# EAGLE design Group12_411_REV3 (EAGLE 9.2.2)
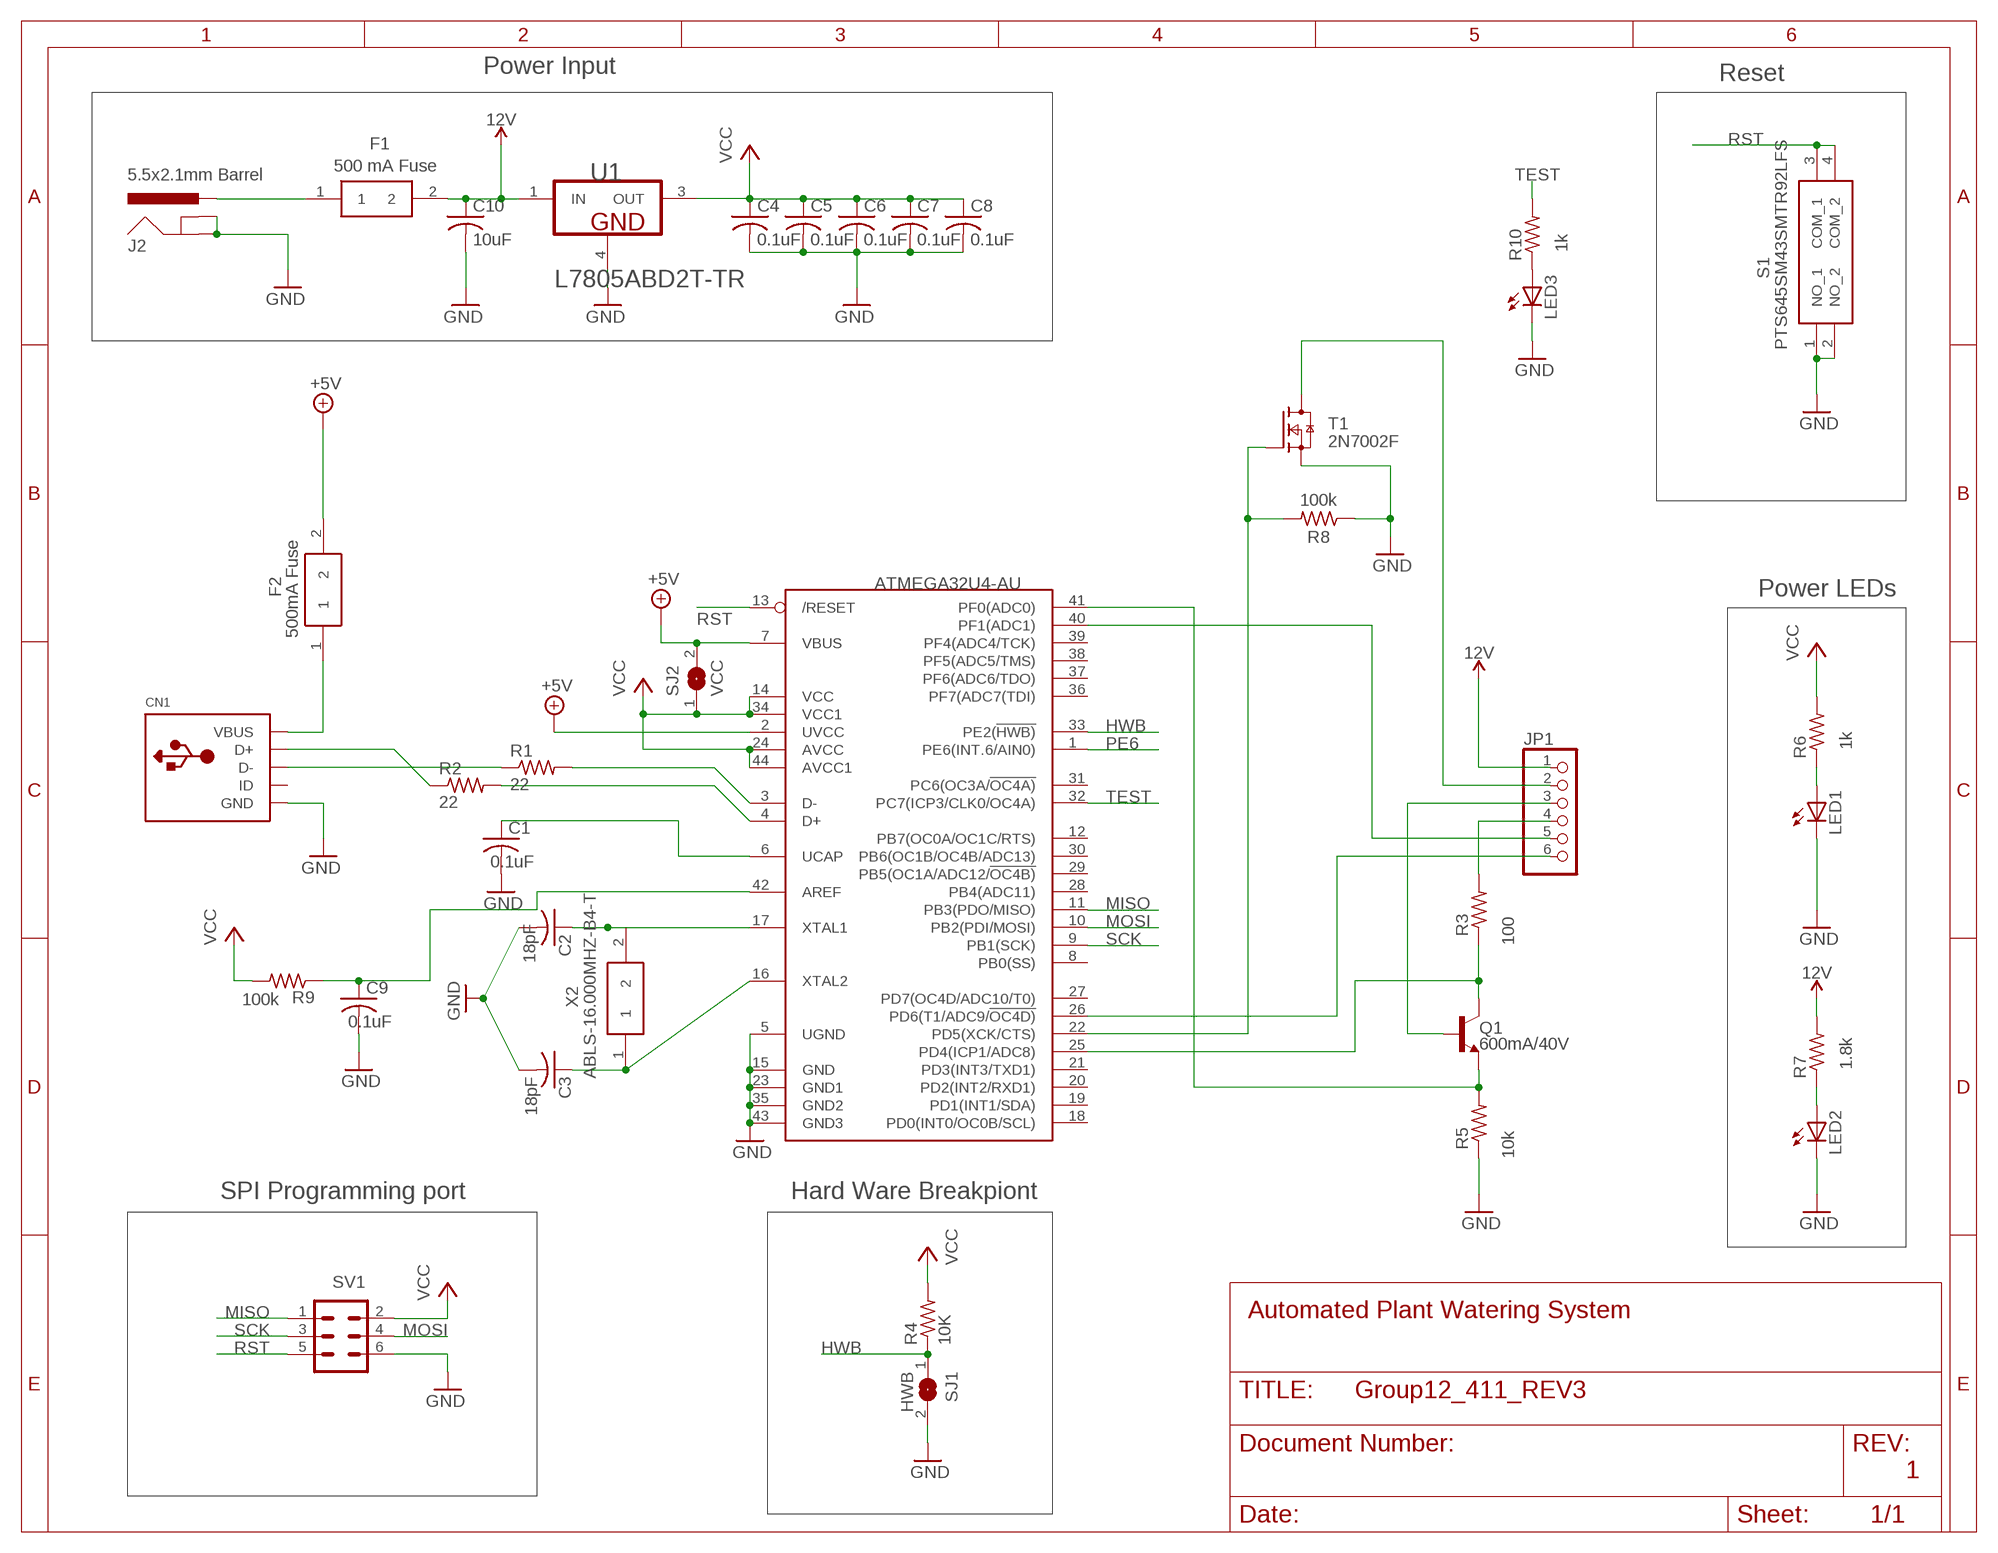
[diagram p0: schematic, sheet 1]
FRAME1 (FRAME_A_L): REV: 1

## Parts
C1  0.1uF  C-USC0805K  [C0805K]
C2  18pF  C-USC0805K  [C0805K]
C3  18pF  C-USC0805K  [C0805K]
C4  0.1uF  C-USC0805K  [C0805K]
C5  0.1uF  C-USC0805K  [C0805K]
C6  0.1uF  C-USC0805K  [C0805K]
C7  0.1uF  C-USC0805K  [C0805K]
C8  0.1uF  C-USC0805K  [C0805K]
C9  0.1uF  C-USC0805K  [C0805K]
C10  10uF  C-USC0805K  [C0805K]
CN1  USBMINIB  [USB-MINIB]
F1  MFU0805FF00500P100  [FUSC2012X55N]
F2  MFU0805FF00500P100  [FUSC2012X55N]
J2  5.5x2.1mm Barrel  POWER_JACKSMD  [POWER_JACK_SMD]
JP1  PINHD-1X6-3.5MM  [1X06-3.5MM]
LED1  LEDCHIP-LED0603  [CHIP-LED0603]
LED2  LEDCHIP-LED0603  [CHIP-LED0603]
LED3  LEDCHIP-LED0603  [CHIP-LED0603]
Q1  600mA/40V  TRANS_NPN-MMBT2222AL  [SOT23-3]
R1  22  R-US_R0805  [R0805]
R2  22  R-US_R0805  [R0805]
R3  22  R-US_R0805  [R0805]
R4  10K  R-US_R0805  [R0805]
R5  22  R-US_R0805  [R0805]
R6  10K  R-US_R0805  [R0805]
R7  10K  R-US_R0805  [R0805]
R8  10K  R-US_R0805  [R0805]
R9  100k  R-US_R0805  [R0805]
R10  10K  R-US_R0805  [R0805]
S1  PTS645SM43SMTR92LFS  [PTS645SMT]
SJ1  HWB  SJ  [SJ]
SJ2  VCC  SJ  [SJ]
SV1  MA03-2  [MA03-2]
T1  2N7002F  [SOT23]
U1  STMICROELECTRONICS_L7805ABD2T-TRSTMICROELECTRONICS_L7805ABD2T-TR_0_0  [STMICROELECTRONICS_L7805ABD2T-TR_0]
U2  ATMEGA32U4-AU  [TQFP44]
X2  ABLS-16.000MHZ-B4-T  [ABLS]

## Nets
12V: C10.1 F1.2 JP1.1 R7.2 U1.1(IN)
+5V: F2.2 SJ2.2 U2.2(UVCC) U2.7(VBUS)
GND: C1.2 C2.2 C3.2 C4.2 C5.2 C6.2 C7.2 C8.2 C9.2 C10.2 CN1.GND J2.GND(GNDBREAK) J2.P$4(GND) LED1.C LED2.C LED3.C R5.1 R8.1 S1.1(NO_1) S1.2(NO_2) SJ1.2 SV1.6 T1.2(S) U1.4(GND) U2.5(UGND) U2.15(GND) U2.23(GND1) U2.35(GND2) U2.43(GND3)
HWB: R4.1 SJ1.1 U2.33(PE2(!HWB))
MISO: SV1.1 U2.11(PB3(PDO/MISO))
MOSI: SV1.4 U2.10(PB2(PDI/MOSI))
N$1: LED3.A R10.1
N$2: CN1.D+ R2.1
N$3: JP1.4 R3.2
N$4: R2.2 U2.4(D+)
N$5: CN1.D- R1.1
N$6: C1.1 U2.6(UCAP)
N$7: R1.2 U2.3(D-)
N$8: C2.1 U2.17(XTAL1) X2.2
N$9: C3.1 U2.16(XTAL2) X2.1
N$10: LED1.A R6.1
N$11: Q1.3(C) R3.1 U2.25(PD4(ICP1/ADC8))
N$12: Q1.2(E) R5.2 U2.41(PF0(ADC0))
N$13: JP1.3 Q1.1(B)
N$14: JP1.2 T1.3(D)
N$15: LED2.A R7.1
N$16: F1.1 J2.VIN0(PWR)
N$17: CN1.VBUS F2.1
N$18: R8.2 T1.1(G) U2.22(PD5(XCK/CTS))
N$19: JP1.5 U2.40(PF1(ADC1))
N$20: JP1.6 U2.26(PD6(T1/ADC9/!OC4D))
N$23: C9.1 R9.1 U2.42(AREF)
PE6: U2.1(PE6(INT.6/AIN0))
RST: S1.3(COM_1) S1.4(COM_2) SV1.5 U2.13(/RESET)
SCK: SV1.3 U2.9(PB1(SCK))
TEST: R10.2 U2.32(PC7(ICP3/CLK0/OC4A))
VCC: C4.1 C5.1 C6.1 C7.1 C8.1 R4.2 R6.2 R9.2 SJ2.1 SV1.2 U1.3(OUT) U2.14(VCC) U2.24(AVCC) U2.34(VCC1) U2.44(AVCC1)
Unconnected: CN1.ID U2.8(PB0(SS)) U2.12(PB7(OC0A/OC1C/RTS)) U2.18(PD0(INT0/OC0B/SCL)) U2.19(PD1(INT1/SDA)) U2.20(PD2(INT2/RXD1)) U2.21(PD3(INT3/TXD1)) U2.27(PD7(OC4D/ADC10/T0)) U2.28(PB4(ADC11)) U2.29(PB5(OC1A/ADC12/!OC4B)) U2.30(PB6(OC1B/OC4B/ADC13)) U2.31(PC6(OC3A/!OC4A)) U2.36(PF7(ADC7(TDI)) U2.37(PF6(ADC6/TDO)) U2.38(PF5(ADC5/TMS)) U2.39(PF4(ADC4/TCK))

## Notes on the sheet
- Power Input | Reset
- Power LEDs
- SPI Programming port | Hard Ware Breakpiont
- Automated Plant Watering System

## Library data of the parts
C1-C10 = adafruit:C-US: CAPACITOR, American symbol
CN1 = adafruit:USB: USB Connectors USBMINIB - Surface Mount Female Mini-B USB Connector 4UConnector: 06564 By microbuilder.eu Thru-hole RA Female Mini-B USB Connector 4UConnector: 18732 By ladyada.net
F1 = SamacSys_Parts:MFU0805FF00500P100: VISHAY - MFU0805FF00500P100. - FUSE, 0805 SMD, 0.5A Source: Datasheet <https://componentsearchengine.com/Datasheets/1/MFU0805FF00500P100.pdf>; DESCRIPTION: VISHAY - MFU0805FF00500P100. - FUSE, 0805 SMD, 0.5A; HEIGHT: 0.55mm; MANUFACTURER_NAME: Vishay; MANUFACTURER_PART_NUMBER: 500 mA Fuse; MOUSER_PART_NUMBER: 594-MFU0805FF00500P1
F2 = SamacSys_Parts:MFU0805FF00500P100: VISHAY - MFU0805FF00500P100. - FUSE, 0805 SMD, 0.5A Source: Datasheet <https://componentsearchengine.com/Datasheets/1/MFU0805FF00500P100.pdf>; DESCRIPTION: VISHAY - MFU0805FF00500P100. - FUSE, 0805 SMD, 0.5A; HEIGHT: 0.55mm; MANUFACTURER_NAME: Vishay; MANUFACTURER_PART_NUMBER: 500mA Fuse; MOUSER_PART_NUMBER: 594-MFU0805FF00500P1
J2 = SparkFun-Connectors:POWER_JACK: Power Jack Connector This is the standard 5.5mm barrel jack for power. The PTH is the most common, proven, reliable, footprint. The Slot footprint only works if the mill layer is transmitted to the PCB fab house so be warned. Here are the connectors we sell at SparkFun: DC Barrel Power Jack/Connector <https://www.sparkfun.com/products/119> (PRT-00119) DC Barrel Power Jack/Connector (SMD) <https://www.sparkfun.com/products/12748> (PRT-12748) DC Barrel Jack Adapter - Breadboard Compatible <https://www.sparkfun.com/products/10811> (PRT-10811) It is used on this SparkFun product (and many, many others): SparkFun RedBoard - Programmed with Arduino <https://www.sparkfun.com/products/12757> (DEV-12757) Also, if you need a mating power supply or connector, please check these out: Wall Adapter Power Supply - 9VDC 650mA <https://www.sparkfun.com/products/298> (TOL-00298) DC Barrel Jack Adapter - Male <https://www.sparkfun.com/products/10287> (PRT-10287); PROD_ID: CONN-08106; SF_ID: PRT-12748
JP1 = adafruit:PINHD-1X6: PIN HEADER
LED1-LED3 = adafruit:LED: LED OSRAM: - CHIPLED LG R971, LG N971, LY N971, LG Q971, LY Q971, LO R971, LY R971 LH N974, LH R974 LS Q976, LO Q976, LY Q976 LO Q996 - Hyper CHIPLED LW Q18S LB Q993, LB Q99A, LB R99A - SideLED LS A670, LO A670, LY A670, LG A670, LP A670 LB A673, LV A673, LT A673, LW A673 LH A674 LY A675 LS A676, LA A676, LO A676, LY A676, LW A676 LS A679, LY A679, LG A679 - Hyper Micro SIDELED® LS Y876, LA Y876, LO Y876, LY Y876 LT Y87S - SmartLED LW L88C, LW L88S LB L89C, LB L89S, LG L890 LS L89K, LO L89K, LY L89K LS L896, LA L896, LO L896, LY L896 - TOPLED LS T670, LO T670, LY T670, LG T670, LP T670 LSG T670, LSP T670, LSY T670, LOP T670, LYG T670 LG T671, LOG T671, LSG T671 LB T673, LV T673, LT T673, LW T673 LH T674 LS T676, LA T676, LO T676, LY T676, LB T676, LH T676, LSB T676, LW T676 LB T67C, LV T67C, LT T67C, LS T67K, LO T67K, LY T67K, LW E67C LS E67B, LA E67B, LO E67B, LY E67B, LB E67C, LV E67C, LT E67C LW T67C LS T679, LY T679, LG T679 LS T770, LO T770, LY T770, LG T770, LP T770 LB T773, LV T773, LT T773, LW T773 LH T774 LS E675, LA E675, LY E675, LS T675 LS T776, LA T776, LO T776, LY T776, LB T776 LHGB T686 LT T68C, LB T68C - Hyper Mini TOPLED® LB M676 - Mini TOPLED Santana® LG M470 LS M47K, LO M47K, LY M47K Source: http://www.osram.convergy.de/
Q1 = SparkFun-DiscreteSemi:TRANS_NPN: NPN transistor Current controlled devices typically used to amplify current or used as a switch. BC547 - COM-08928 <http://www.sparkfun.com/products/8928> (TO-92 45V 100mA) (1.Collector 2.Base 3.Emitter) 2N3904 - COM-00521 <http://www.sparkfun.com/products/521> (TO-92 40V 200mA) (1.Emitter 2.Base 3.Collector) P2N2222A - COM-12852 <http://www.sparkfun.com/products/12852> (TO-92 40V 600mA) (1.Collector 2.Base 3.Emitter); PROD_ID: TRANS-08049
R1 R2 R4 R9 = adafruit:R-US_: RESISTOR, American symbol
R3 = adafruit:R-US_: RESISTOR, American symbol; R: 100
R5 = adafruit:R-US_: RESISTOR, American symbol; R: 10k
R6 R10 = adafruit:R-US_: RESISTOR, American symbol; R: 1k
R7 = adafruit:R-US_: RESISTOR, American symbol; R: 1.8k
R8 = adafruit:R-US_: RESISTOR, American symbol; R: 100k
S1 = SamacSys_Parts:PTS645SM43SMTR92LFS: Tactile Switches SWITCH TACTILE Source: Datasheet <https://www.mouser.be/datasheet/2/60/pts645-1382776.pdf>; DESCRIPTION: Tactile Switches SWITCH TACTILE; HEIGHT: mm; MANUFACTURER_NAME: C&K Switches; MANUFACTURER_PART_NUMBER: PTS645SM43SMTR92LFS; MOUSER_PART_NUMBER: 611-PTS645SM43SMTR92
SJ1 SJ2 = jumper:SJ: SMD solder JUMPER
SV1 = con-lstb:MA03-2: PIN HEADER; OC_FARNELL: unknown; OC_NEWARK: unknown
T1 = NXP_60_26022015:2N7002: N-channel TrenchMOS FET N-channel enhancement mode Field-Effect Transistor (FET) in a plastic package using TrenchMOS technology. AAL Eindhoven MK
U1 = STMicroelectronics - L7805ABD2T-TR:STMICROELECTRONICS_L7805ABD2T-TR: PM-REG-L4940-SOT3; CIIVA_IDS: 1170709; COMPONENT_LINK_1_DESCRIPTION: Manufacturer URL; COMPONENT_LINK_1_URL: http://www.st.com; DATASHEET: http://www.st.com/internet/com/TECHNICAL_RESOURCES/TECHNICAL_LITERATURE/DATASHEET/CD00000444.pdf; DATASHEET_VERSION: 16/11/2011; FOOTPRINT_VARIANT_NAME_0: Level C; FOOTPRINT_VARIANT_NAME_1: Level B; FOOTPRINT_VARIANT_NAME_2: Level A; IMPORTED: yes; IMPORTED_FROM: vault; IMPORT_TS: 1521848318; MF: STMicroelectronics; MPN: L7805ABD2T-TR; PACKAGE: TO-263; PACKAGE_DESCRIPTION: 3-Pin Transistor Outline Package 2.54 mm Pitch, 15.4 mm Lead Span (D2PAK); PACKAGE_VERSION: 2011; PREFIX: U; RELEASE_DATE: 1329863996; VAULT_GUID: F9E86E7E-C0C5-4482-A014-8AF9A03DEA17; VAULT_REVISION: EBC7F444-4DCD-48A7-B3F0-D4FCAD21B5F4
U2 = adafruit:ATMEGA32U4: http://www.ladyada.net/library/eagle
X2 = SamacSys_Parts:ABLS-16.000MHZ-B4-T: ABRACON - ABLS-16.000MHZ-B4-T - CRYSTAL, 16MHZ, 18PF, HC-49US Source: Datasheet <https://componentsearchengine.com/Datasheets/1/ABLS-16.000MHZ-B4-T.pdf>; DESCRIPTION: ABRACON - ABLS-16.000MHZ-B4-T - CRYSTAL, 16MHZ, 18PF, HC-49US; HEIGHT: mm; MANUFACTURER_NAME: ABRACON; MANUFACTURER_PART_NUMBER: ABLS-16.000MHZ-B4-T; MOUSER_PART_NUMBER: 815-ABLS-16.0M-T

## Net classes
0 default: width 0.305 mm

## Board
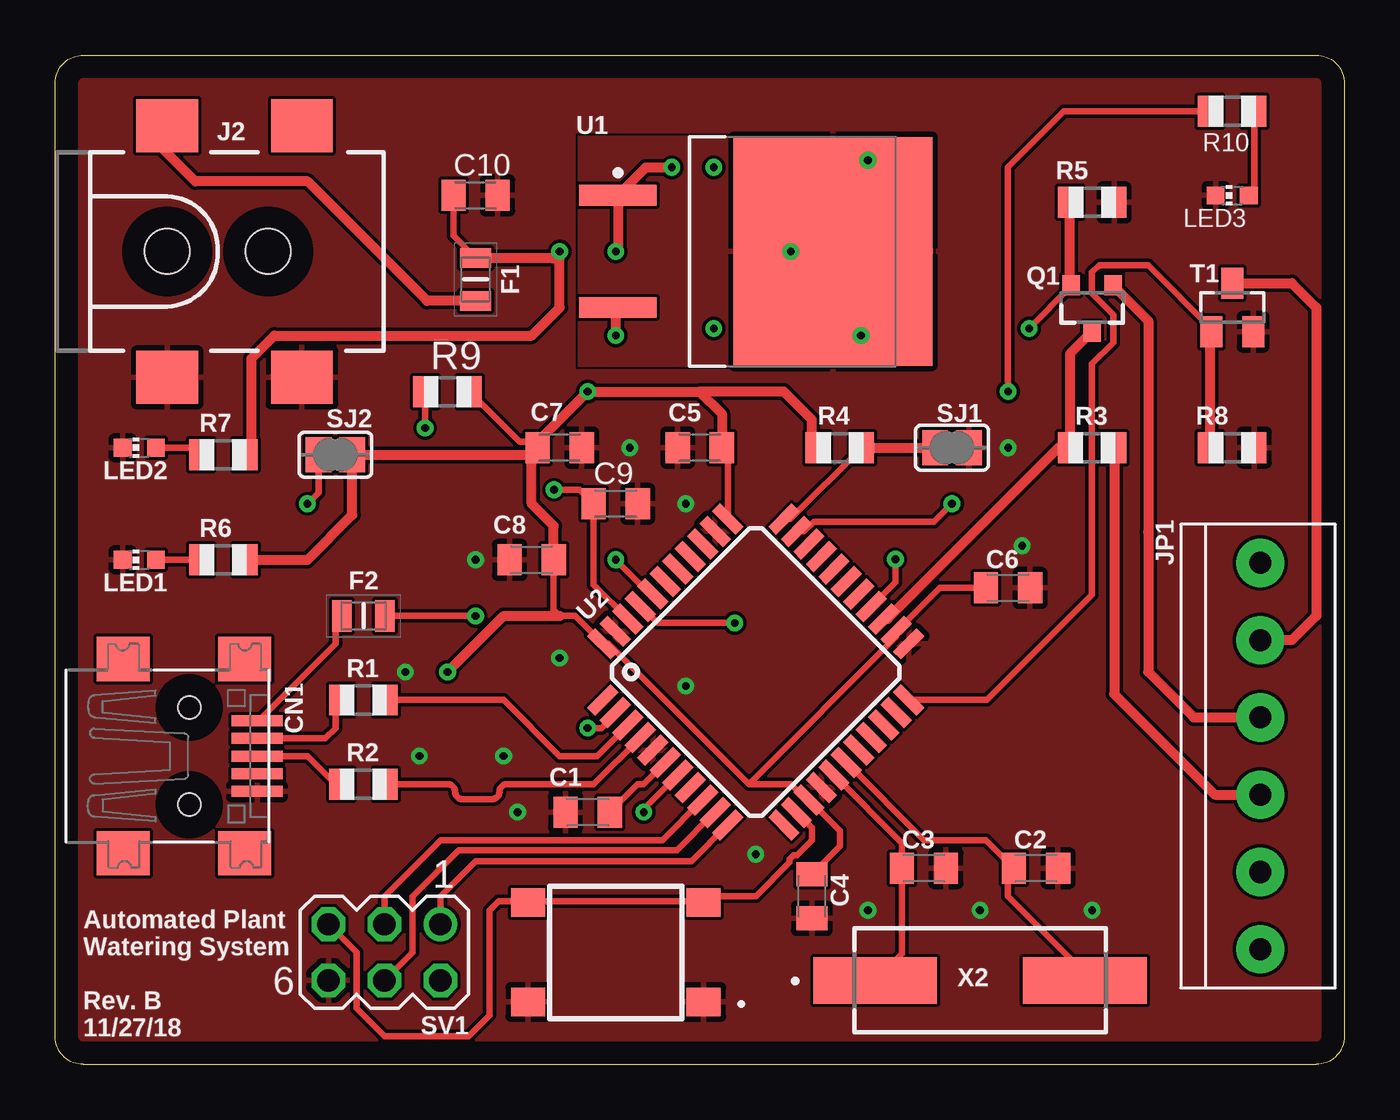
[diagram p1: board, top side]
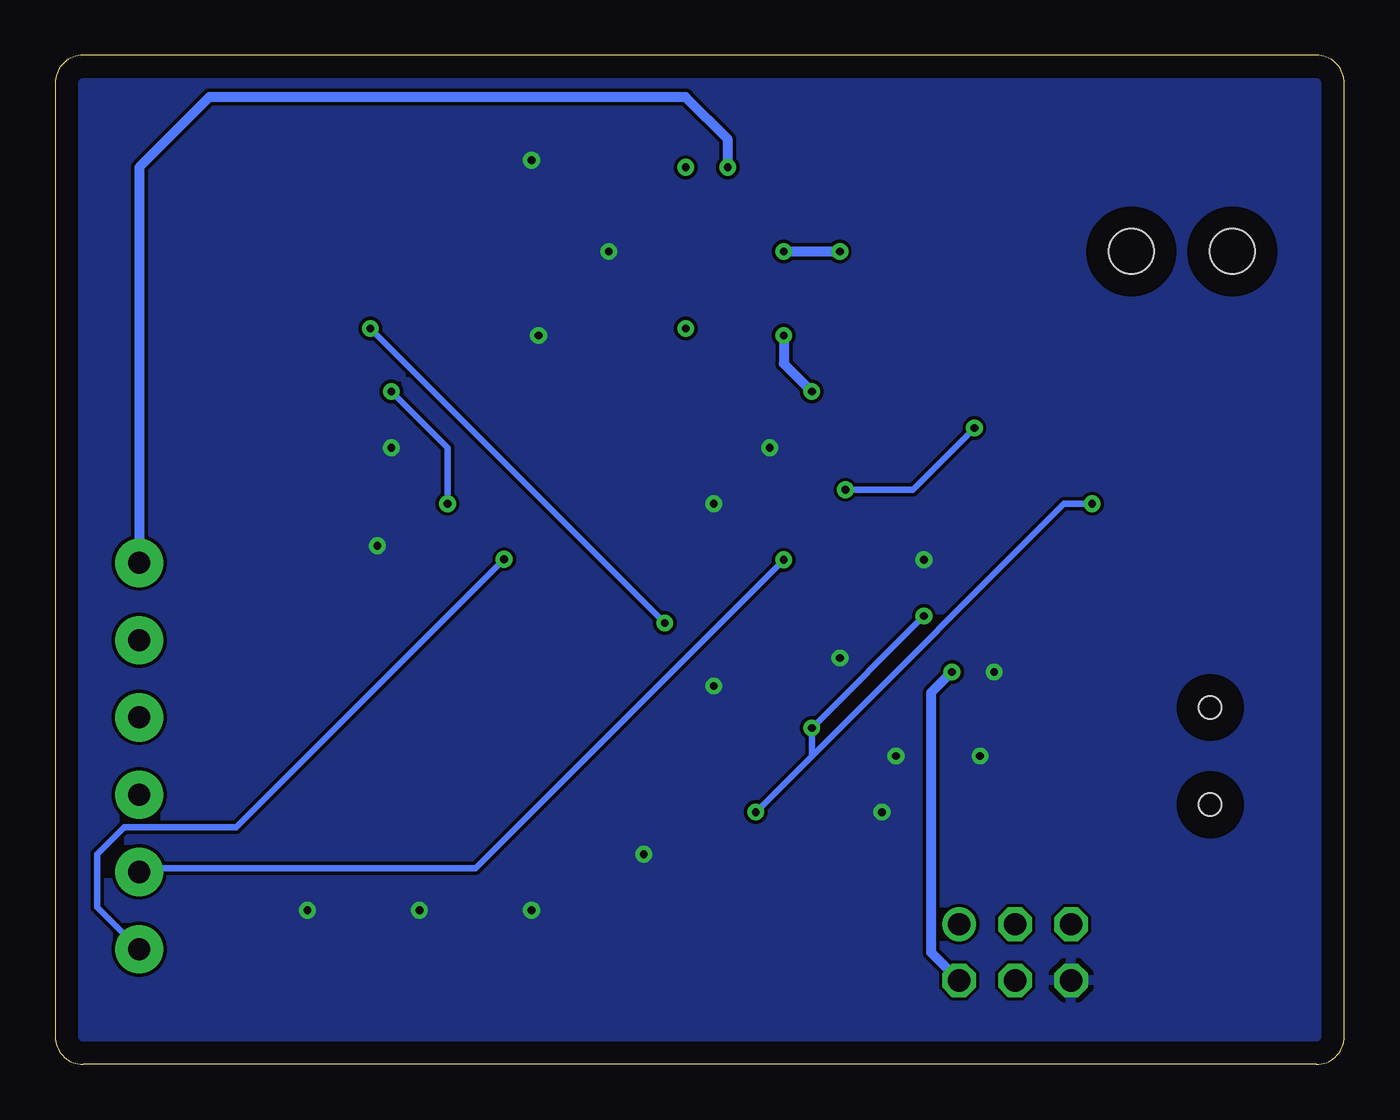
[diagram p2: board, bottom side, seen from below]

Size 58.42 x 45.72 mm. Coordinates in mm from the lower left corner, seen from the top.
Outline: 1.27,0 arc-90 0,1.27 0,44.45 arc-90 1.27,45.72 57.15,45.72 arc-90 58.42,44.45 58.42,1.27 arc-90 57.15,0 1.27,0
Copper layers (1*16): Top 0.035mm / dielectric 1.5mm / Bottom 0.035mm
Design rules "default *": minimum track width 6mil, minimum drill 0.35mm, track to track 6mil, track to pad 6mil, pad to pad 6mil, via to via 6mil, smd to smd 6mil, copper to edge 40mil, drill to drill 6mil, minimum pad ring 10mil, minimum via ring 8mil, stop-mask expansion 4mil, vias tented up to drill 0mil, thermal gap 10mil

### Footprints (pad centres in the part's own frame; a part is rotated, then mirrored left to right if it is on the bottom)
C0805K = smd 1.1 x 1.4: 1 -1,0; 2 1,0
USB-MINIB = smd 0.5 x 2.308: D+ 0,4.064; D- -0.8,4.064; GND 1.6,4.064; ID 0.8,4.064; VBUS -1.6,4.064 | smd 2 x 2.4: GND1 -4.4,-2; GND2 -4.4,3.5; GND3 4.4,3.5; GND4 4.4,-2 | hole 1: -2.2,1; 2.2,1
FUSC2012X55N = smd 0.89 x 1.42: 1 -0.97,0; 2 0.97,0
POWER_JACK_SMD = smd 2.8 x 2.4: GND 0,-5.7; P$4 6.1,-5.7; VIN0 0,5.7; VIN1 6.1,5.7 | hole 2.032: 0,0; 4.572,0
1X06-3.5MM = drill 1 pad 2.184: 1 -8.75,0; 2 -5.25,0; 3 -1.75,0; 4 1.75,0; 5 5.25,0; 6 8.75,0
CHIP-LED0603 = smd 0.8 x 0.8: A 0,-0.75; C 0,0.75
SOT23-3 = smd 0.8 x 0.9: 1 -0.95,-1; 2 0.95,-1; 3 0,1.1
R0805 = smd 1.1 x 1.4: 1 -1,0; 2 1,0
PTS645SMT = smd 1.55 x 1.3: 1 -3.975,2.25; 2 3.975,2.25; 3 -3.975,-2.25; 4 3.975,-2.25
SJ = smd 1.168 x 1.6: 1 -0.762,0; 2 0.762,0
MA03-2 = drill 1.016: 1 -2.54,-1.27 | drill 1.016 octagon: 2 -2.54,1.27; 3 0,-1.27; 4 0,1.27; 5 2.54,-1.27; 6 2.54,1.27
SOT23 = smd 1 x 1.4: 1 -0.95,-1.1; 2 0.95,-1.1; 3 0,1.1
STMICROELECTRONICS_L7805ABD2T-TR_0 = smd 3.5 x 0.95: 1 -6.25,2.54; 3 -6.25,-2.54 | smd 9 x 10.35: 4 3.5,0
TQFP44 = smd 1.5 x 0.5: 1 -5.8,4; 2 -5.8,3.2; 3 -5.8,2.4; 4 -5.8,1.6; 5 -5.8,0.8; 6 -5.8,0; 7 -5.8,-0.8; 8 -5.8,-1.6; 9 -5.8,-2.4; 10 -5.8,-3.2; 11 -5.8,-4; 23 5.8,-4; 24 5.8,-3.2; 25 5.8,-2.4; 26 5.8,-1.6; 27 5.8,-0.8; 28 5.8,0; 29 5.8,0.8; 30 5.8,1.6; 31 5.8,2.4; 32 5.8,3.2; 33 5.8,4 | smd 0.5 x 1.5: 12 -4,-5.8; 13 -3.2,-5.8; 14 -2.4,-5.8; 15 -1.6,-5.8; 16 -0.8,-5.8; 17 0,-5.8; 18 0.8,-5.8; 19 1.6,-5.8; 20 2.4,-5.8; 21 3.2,-5.8; 22 4,-5.8; 34 4,5.8; 35 3.2,5.8; 36 2.4,5.8; 37 1.6,5.8; 38 0.8,5.8; 39 0,5.8; 40 -0.8,5.8; 41 -1.6,5.8; 42 -2.4,5.8; 43 -3.2,5.8; 44 -4,5.8
ABLS = smd 5.6 x 2.1: 1 -4.75,0; 2 4.75,0

### Placement (x,y rotation side)
C1  24.13,11.43 180 top
C2  44.45,8.89 0 top
C3  39.37,8.89 0 top
C4  34.29,7.62 270 top
C5  29.21,27.94 180 top
C6  43.18,21.59 0 top
C7  22.86,27.94 0 top
C8  21.59,22.86 180 top
C9  25.4,25.4 0 top
C10  19.05,39.37 0 top
CN1  5.08,13.97 270 top
F1  19.05,35.56 90 top
F2  13.97,20.32 0 top
J2  5.08,36.83 0 top
JP1  54.61,13.97 270 top
LED1  3.81,22.86 90 top
LED2  3.81,27.94 90 top
LED3  53.34,39.37 90 top
Q1  46.99,34.29 180 top
R1  13.97,16.51 0 top
R2  13.97,12.7 0 top
R3  46.99,27.94 0 top
R4  35.56,27.94 180 top
R5  46.99,39.05 180 top
R6  7.62,22.86 0 top
R7  7.62,27.62 0 top
R8  53.34,27.94 180 top
R9  17.78,30.48 0 top
R10  53.34,43.18 180 top
S1  25.4,5.08 180 top
SJ1  40.64,27.94 0 top
SJ2  12.7,27.62 180 top
SV1  14.92,5.08 180 top
T1  53.34,34.29 0 top
U1  31.75,36.83 0 top
U2  31.75,17.78 45 top
X2  41.91,3.81 0 top

### Tracks (layer width: path | path; a pad name or v marks a point on that pad's centre or on a via)
12V  (via drill 0.35)
  Top 0.305: C10.1 18.05,37.53 F1.2 | 8.89,27.94 8.62,27.67 R7.2
  Top 0.457: v25.4,36.83 25.5,36.93 U1.1 26.77,40.64 v27.94,40.64 | F1.2 19.07,36.51 22.54,36.51 v22.86,36.83 22.86,34.29 21.59,33.02 9.93,33.02 8.89,31.98 8.89,27.94
  Bottom 0.457: v25.4,36.83 v22.86,36.83 | v27.94,40.64 27.94,41.91 29.85,43.81 51.44,43.81 54.61,40.64 JP1.1
+5V  (via drill 0.35)
  Top 0.305: v19.05,20.32 F2.2 | v24.13,15.24 24.76,15.24 25.39,15.86 U2.2 | SJ2.2 11.94,25.91 v11.43,25.4 | v26.67,11.43 26.67,11.57 U2.7
  Bottom 0.305: v19.05,20.32 v24.13,15.24 24.13,13.97 | v26.67,11.43 24.13,13.97 | 24.13,13.97 12.7,25.4 v11.43,25.4
GND  (via drill 0.35)
  Top 0.305: U2.5 26.99,14.29 27.01,14.24
  other vias: 28.57,17.14 22.86,18.41 19.05,22.86 15.88,17.78 16.51,13.97 20.32,13.97 20.95,11.43 36.83,6.98 41.91,6.98 46.99,6.98 31.75,9.52 28.57,25.4 43.82,23.5 26.04,27.94 43.18,27.94 36.51,33.02 36.83,40.96 33.34,36.83
  pour Top: 1.27,46.99 63.5,46.99 63.5,-1.27 -5.08,-1.27 -5.08,40.64
  pour Bottom: -0.63,46.36 60.96,46.36 60.96,-1.9 -1.91,-1.9 -1.91,45.08
HWB
  Top 0.305: R4.1 33.33,24.71 U2.33
  Top 0.457: R4.1 SJ1.1
MISO
  Top 0.305: U2.11 28.83,9.21 19.05,9.21 17.46,7.62 SV1.1
MOSI
  Top 0.305: SV1.4 16.19,5.08 16.19,7.62 18.27,9.7 28.17,9.7 29.88,11.42 U2.10
N$1
  Top 0.305: R10.1 54.34,39.62 LED3.A
N$2
  Top 0.305: R2.1 12.7,12.7 11.43,13.97 CN1.D+
N$3
  Top 0.457: R3.2 47.99,16.78 52.55,12.22 JP1.4
N$4
  Top 0.305: R2.2 17.78,12.7 arc-90 18.12,12.36 arc90 18.47,12.01 19.79,12.01 arc90 20.13,12.36 arc-90 20.47,12.7 24.41,12.7 U2.4
N$5
  Top 0.305: R1.1 12.7,16.24 12.7,15.24 12.23,14.77 CN1.D-
N$6
  Top 0.305: C1.1 26.4,12.7 26.67,12.7 U2.6
N$7
  Top 0.305: R1.2 20.32,16.51 22.86,13.97 24.55,13.97 U2.3
N$8
  Top 0.305: X2.2 46.66,4.14 43.18,7.62 43.18,8.62 C2.1 42.18,10.16 39.37,10.16 U2.17
N$9
  Top 0.305: U2.16 38.37,10.03 C3.1 38.37,5.02 X2.1
N$10
  Top 0.305: R6.1 LED1.A
N$11
  Top 0.457: U2.25 37.72,20.18 45.47,27.94 R3.1 45.99,32.19 Q1.3
N$12  (via drill 0.35)
  Top 0.305: v30.8,20 27.3,20 26.67,20.64 U2.41 | v44.13,33.34 46.04,35.24 Q1.2
  Top 0.457: Q1.2 45.99,35.34 R5.2
  Bottom 0.305: v44.13,33.34 v30.8,20
N$13
  Top 0.457: Q1.1 49.53,33.7 49.53,24.13 49.53,17.78 51.59,15.72 JP1.3
N$14
  Top 0.457: T1.3 56.05,35.39 57.15,34.29 57.15,20.32 56.05,19.22 JP1.2
N$15
  Top 0.305: LED2.A 6.3,27.94 R7.1
N$16
  Top 0.457: F1.1 16.84,34.59 11.43,40 6.35,40 4.44,41.91 5.07,42.53 J2.VIN0
N$17
  Top 0.305: F2.1 12.7,20.32 12.7,19.05 9.21,15.56 CN1.VBUS
N$18
  Top 0.305: U2.22 38.73,16.51 42.23,16.51 46.99,21.27 46.99,31.75 47.94,32.7 47.94,33.97 46.99,34.92 46.99,35.88 47.31,36.19 49.53,36.19 52.39,33.34 T1.1
  Top 0.457: R8.2 52.34,33.14 T1.1
N$19  (via drill 0.35)
  Top 0.305: v25.4,22.86 26.94,21.32 U2.40
  Bottom 0.305: JP1.5 54.44,8.89 39.37,8.89 v25.4,22.86
N$20  (via drill 0.35)
  Top 0.305: v38.07,22.89 38.07,21.84 U2.26
  Bottom 0.305: JP1.6 56.52,7.12 56.52,9.52 55.29,10.75 50.21,10.75 v38.07,22.89
N$21  (via drill 0.35)
  other vias: 29.85,40.64
N$22  (via drill 0.35)
  other vias: 29.85,33.34
N$23  (via drill 0.35)
  Top 0.305: U2.42 24.4,21.74 C9.1 23.77,26.04 v22.61,26.04 | v16.76,28.83 16.76,30.46 R9.1
  Bottom 0.305: v22.61,26.04 19.56,26.04 v16.76,28.83
RST
  Top 0.305: S1.3 29.44,7.39 | 29.44,7.39 29.66,7.62 31.75,7.62 33.29,9.16 33.29,9.3 33.46,9.48 33.61,9.48 34.29,10.16 34.29,10.71 U2.13 | S1.4 21.49,7.39 | 21.49,7.39 29.44,7.39 | SV1.5 13.65,5.08 13.65,2.54 14.92,1.27 18.73,1.27 19.68,2.22 19.68,6.98 20.09,7.39 21.49,7.39
SCK
  Top 0.305: U2.9 27.52,10.16 17.46,10.16 14.92,7.62 SV1.3
TEST  (via drill 0.35)
  Top 0.305: U2.32 33.94,24.14 34.38,24.59 39.83,24.59 v40.64,25.4 | v43.18,30.48 43.18,40.64 45.72,43.18 R10.2
  Bottom 0.305: v40.64,25.4 40.64,27.94 v43.18,30.48
VCC  (via drill 0.35)
  Top 0.305: C6.1 40.09,21.59 U2.24 38.1,19.37 31.43,12.7 | C4.1 35.56,9.89 35.56,10.58 U2.14 33.97,12.07 33.34,12.7 31.43,12.7 | C8.1 22.59,20.59 22.86,20.32 23.55,20.32 U2.44 25.08,19.05 31.43,12.7 | U2.34 30.48,24.76 30.48,27.94 C5.1 | R9.2 21.05,28.21 21.86,28.21
  Top 0.457: U1.3 25.4,34.19 v25.4,33.02 | C7.1 21.86,28.21 v24.13,30.48 29.21,30.48 | C7.1 21.86,27.62 SJ2.1 13.46,24.89 11.43,22.86 R6.2 | 29.21,30.48 30.21,29.48 C5.1 | R4.2 34.29,28.21 34.29,29.21 33.02,30.48 29.21,30.48 | C8.1 22.59,24.4 21.59,25.4 21.59,27.67 C7.1 | v17.78,17.78 20.32,20.32 22.86,20.32
  Bottom 0.457: v25.4,33.02 25.4,31.75 v24.13,30.48 | SV1.2 18.73,5.08 18.73,16.83 v17.78,17.78

### Text on the board
tPlace: Automated Plant / Watering System / / Rev. B / 11/27/18